# Altium schematic sheet Sheet1.SchDoc
size A4
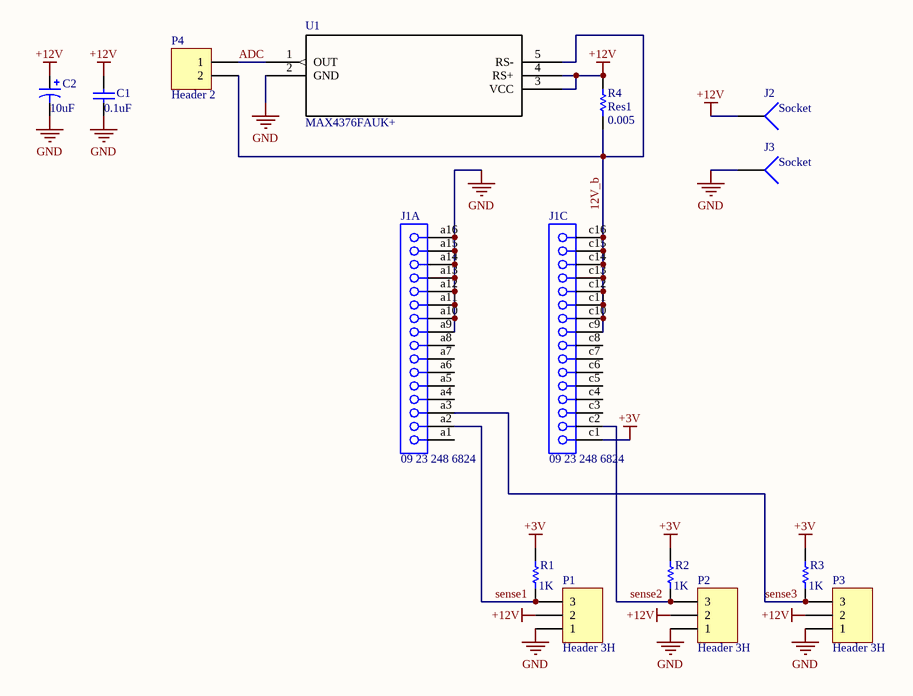
[diagram p0: Sheet1.SchDoc]

## Parts
C1  value 0.1uF  [C0805]  (hidden comment: Cap)
C2  value 10uF  [C1210_N]  (hidden comment: Cap Pol1)
J1  09 23 248 6824  [0923248x824]  (parts A,C of 4)
J2  Socket  [PIN1]
J3  Socket  [PIN1]
P1  Header 3H  [HDR1X3H]
P2  Header 3H  [HDR1X3H]
P3  Header 3H  [HDR1X3H]
P4  Header 2  [HDR1X2]
R1  value 1K  [AXIAL-0.3]  (hidden comment: Res1)
R2  value 1K  [AXIAL-0.3]  (hidden comment: Res1)
R3  value 1K  [AXIAL-0.3]  (hidden comment: Res1)
R4  Res1  value 0.005  [C1206]
U1  MAX4376FAUK+  [21-0057F]

## Nets
+3V: J1.c1 R1.2 R2.2 R3.2
+12V: C1.2 C2.1 J2.1 P1.2 P2.2 P3.2 R4.2 U1.3(VCC) U1.4(RS+)
GND: C1.1 C2.2 J1.a9 J1.a10 J1.a11 J1.a12 J1.a13 J1.a14 J1.a15 J1.a16 J3.1 P1.1 P2.1 P3.1 U1.2(GND)
12V_b: J1.c9 J1.c10 J1.c11 J1.c12 J1.c13 J1.c14 J1.c15 J1.c16 P4.2 R4.1 U1.5(RS-)
ADC: P4.1 U1.1(OUT)
sense1: J1.a2 P1.3 R1.1
sense2: J1.c2 P2.3 R2.1
sense3: J1.a3 P3.3 R3.1

Not connected (* = marked no-connect by the designer): J1 a1 a4 a5 a6 a7 a8 c3 c4 c5 c6 c7 c8

## Library data of the parts
C1 = Cap Semi: Capacitor (Semiconductor SIM Model); Published: 8-Jun-2000; LatestRevisionDate: 29-May-2009; LatestRevisionNote: IPC-7351 Footprint Added.; PackageReference: C1206; Publisher: Altium Limited; PackageDescription: Chip Capacitor
C2 = Cap Pol1: Polarized Capacitor (Radial); Published: 8-Jun-2000; LatestRevisionDate: 17-Jul-2002; LatestRevisionNote: Re-released for DXP Platform.; PackageReference: RB7.6-15; Publisher: Altium Limited; PackageDescription: Polarized Capacitor (Radial); 2 Leads
J1 = 09 23 248 6824: Eurocard DIN 41612, Type 2C, Half Size, 48 Position, Rows a+b+c, Performance level 2, Female, Lead 2.9 mm, Pitch 2.54 mm; DrillSize: Corresponds to nominal value.; Published: 6-Oct-2005; DatasheetDocument: 02-Jun-2003; PackageDocument: 08-Feb-2002; PackageReference: 0923248x824; Publisher: Altium Limited; ComponentLink1Description: Manufacturer Link; ComponentLink1URL: http://www.harting.com/; ComponentLink2Description: Packaging Specification; ComponentLink2URL: http://www.harkis.harting.com/_gds/pdf/TB_0923248x824_BL01_R30232.pdf
P1-P3 = Header 3H: Header, 3-Pin, Right Angle; LatestRevisionDate: 17-Jul-2002; LatestRevisionNote: Re-released for DXP Platform.; Publisher: Altium Limited
P4 = Header 2: Header, 2-Pin; LatestRevisionDate: 17-Jul-2002; LatestRevisionNote: Re-released for DXP Platform.; Publisher: Altium Limited
R1-R4 = Res1: Resistor; Published: 8-Jun-2000; LatestRevisionDate: 17-Jul-2002; LatestRevisionNote: Re-released for DXP Platform.; PackageReference: AXIAL-0.3; Publisher: Altium Limited; PackageDescription: Axial Device, Thru-Hole; 2 Leads; 0.3 in Pin Spacing
U1 = MAX4376FAUK+: Imported; Vendor: MAXIM; Manufacturer_Part_Number: max4376fauk+; RefDes: RefDes; Type: DEV; Value: Value
J2 J3 = Socket: LatestRevisionDate: 17-Jul-2002; LatestRevisionNote: Re-released for DXP Platform.; Publisher: Altium Limited